# Altium schematic sheet V_2.SchDoc
size A3
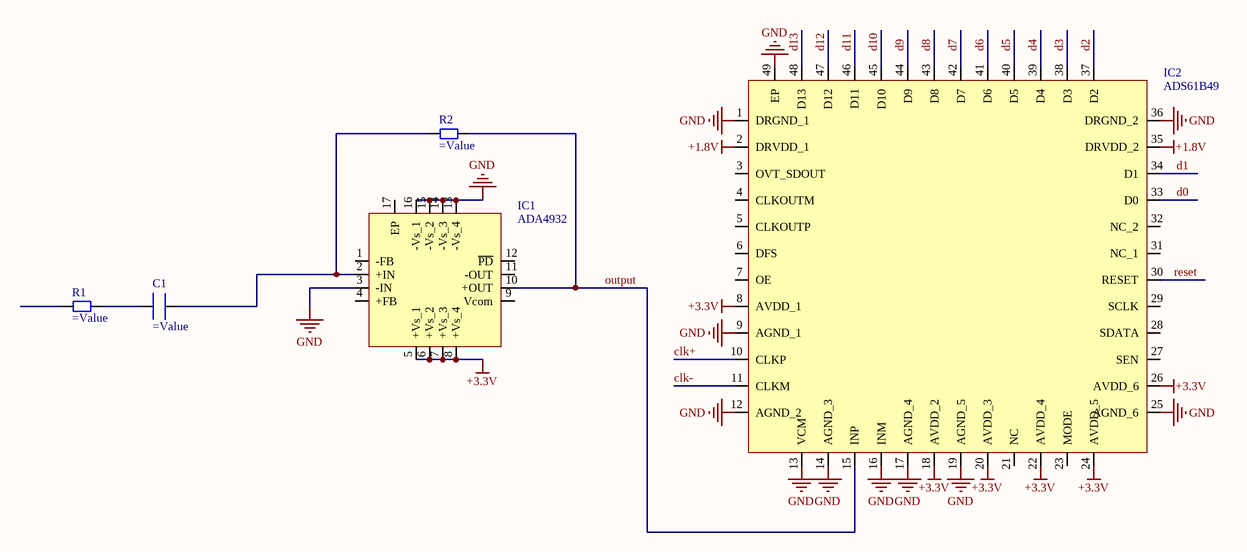
[diagram p0: V_2.SchDoc]

## Parts
C1  (no value)  [Copasitor]
IC1  ADA4932  [ADA4932]
IC2  ADS61B49  [ADS61B49]
R1  (no value)  [Res]
R2  (no value)  [Res]

## Nets
+1.8V: IC2.2(DRVDD_1) IC2.35(DRVDD_2)
+3.3V: IC1.5(+Vs_1) IC1.6(+Vs_2) IC1.7(+Vs_3) IC1.8(+Vs_4) IC2.8(AVDD_1) IC2.18(AVDD_2) IC2.20(AVDD_3) IC2.22(AVDD_4) IC2.24(AVDD_5) IC2.26(AVDD_6)
GND: IC1.3(-IN) IC1.13(-Vs_4) IC1.14(-Vs_3) IC1.15(-Vs_2) IC1.16(-Vs_1) IC2.1(DRGND_1) IC2.9(AGND_1) IC2.12(AGND_2) IC2.13(VCM) IC2.14(AGND_3) IC2.16(INM) IC2.17(AGND_4) IC2.19(AGND_5) IC2.25(AGND_6) IC2.36(DRGND_2) IC2.49(EP)
clk+: IC2.10(CLKP)
clk-: IC2.11(CLKM)
d0: IC2.33(D0)
d1: IC2.34(D1)
d2: IC2.37(D2)
d3: IC2.38(D3)
d4: IC2.39(D4)
d5: IC2.40(D5)
d6: IC2.41(D6)
d7: IC2.42(D7)
d8: IC2.43(D8)
d9: IC2.44(D9)
d10: IC2.45(D10)
d11: IC2.46(D11)
d12: IC2.47(D12)
d13: IC2.48(D13)
output: IC1.10(+OUT) IC2.15(INP) R2.1
reset: IC2.30(RESET)
NetC1_1: C1.1 R1.1
NetC1_2: C1.2 IC1.2(+IN) R2.2

Not connected (* = marked no-connect by the designer): IC1 1(-FB) 4(+FB) 9(Vcom) 11(-OUT) 12(~{PD}) 17(EP); IC2 3(OVT_SDOUT) 4(CLKOUTM) 5(CLKOUTP) 6(DFS) 7(OE) 21(NC) 23(MODE) 27(SEN) 28(SDATA) 29(SCLK) 31(NC_1) 32(NC_2); R1 2

## Library data of the parts
C1 = Copasitor
R1 R2 = Resistor